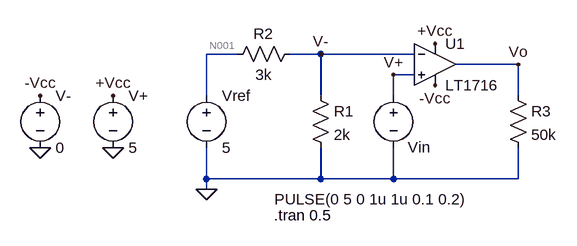
[diagram p0: schematic Comparador.asc]
Comparador.asc, the LTspice schematic file:
Version 4.1
SHEET 1 912 680
WIRE 336 32 288 32
WIRE 464 32 416 32
WIRE 608 32 464 32
WIRE 768 48 672 48
WIRE 608 64 576 64
WIRE 288 96 288 32
WIRE 464 96 464 32
WIRE 576 96 576 64
WIRE 768 96 768 48
WIRE 288 224 288 176
WIRE 464 224 464 176
WIRE 464 224 288 224
WIRE 576 224 576 176
WIRE 576 224 464 224
WIRE 768 224 768 176
WIRE 768 224 576 224
WIRE 288 240 288 224
FLAG 32 176 0
FLAG 144 176 0
FLAG 32 96 -Vcc
FLAG 144 96 +Vcc
FLAG 288 240 0
FLAG 640 80 -Vcc
FLAG 640 16 +Vcc
FLAG 464 32 V-
FLAG 576 64 V+
FLAG 768 48 Vo
SYMBOL voltage 32 80 R0
WINDOW 123 0 0 Left 0
WINDOW 39 0 0 Left 0
SYMATTR InstName V-
SYMATTR Value 0
SYMBOL voltage 144 80 R0
WINDOW 123 0 0 Left 0
WINDOW 39 0 0 Left 0
SYMATTR InstName V+
SYMATTR Value 5
SYMBOL voltage 288 80 R0
WINDOW 123 0 0 Left 0
WINDOW 39 0 0 Left 0
SYMATTR InstName Vref
SYMATTR Value 5
SYMBOL res 448 80 R0
SYMATTR InstName R1
SYMATTR Value 2k
SYMBOL res 432 16 R90
WINDOW 0 0 56 VBottom 2
WINDOW 3 32 56 VTop 2
SYMATTR InstName R2
SYMATTR Value 3k
SYMBOL voltage 576 80 R0
WINDOW 0 22 95 Left 2
WINDOW 3 -183 175 Left 2
WINDOW 123 0 0 Left 0
WINDOW 39 0 0 Left 0
SYMATTR InstName Vin
SYMATTR Value PULSE(0 5 0 1u 1u 0.1 0.2)
SYMBOL res 752 80 R0
SYMATTR InstName R3
SYMATTR Value 50k
SYMBOL Comparators\\LT1716 640 48 R0
SYMATTR InstName U1
TEXT 392 280 Left 2 !.tran 0.5

The netlist it stands for:
* Comparador.asc
V- -Vcc 0 0
V+ +Vcc 0 5
Vref N001 0 5
R1 V- 0 2k
R2 V- N001 3k
Vin V+ 0 PULSE(0 5 0 1u 1u 0.1 0.2)
R3 Vo 0 50k
X§U1 V+ V- +Vcc -Vcc Vo LT1716  ; pins In+ In- V+ V- OUT
.tran 0.5
.lib LTC1.lib
.backanno
.end

* Results of the author's LTspice run, read from the files saved beside the schematic
* Operating Point, zero values left out:
*   V(+vcc) = 5 V
*   V(v-) = 2 V
*   V(n001) = 5 V
*   V(vo) = 21.91 mV
*   I(R2) = -1 mA
*   I(V-) = 41.71 µA
*   I(Vref) = -1 mA
*   I(Vin) = 3.5 nA
*   I(V+) = -42.15 µA
*   I(R3) = 438.1 nA
*   I(R1) = 1 mA
*   Ix(u1:1) = -3.5 nA
*   Ix(u1:3) = 42.15 µA
*   Ix(u1:4) = -41.71 µA
*   Ix(u1:5) = -438.1 nA
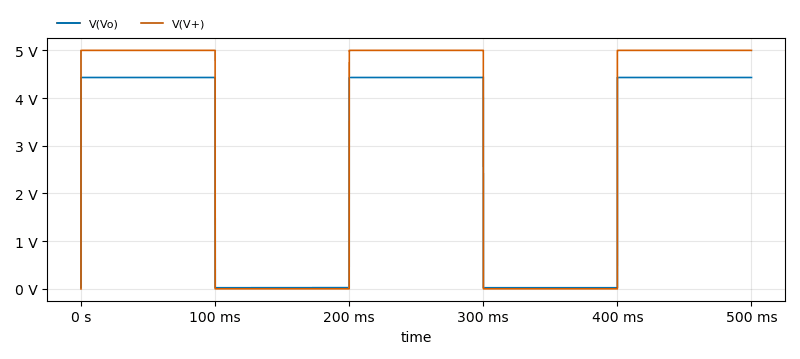
[diagram p1: Transient Analysis of Comparador.asc, plotted from the saved traces]
* Transient Analysis, 1 run:
*   V(Vo): min 21.9 mV, max 4.433 V, average 2.667 V, rms 3.432 V, last 4.431 V
*   V(V+): min 0 V, max 5 V, average 3 V, rms 3.873 V, last 5 V